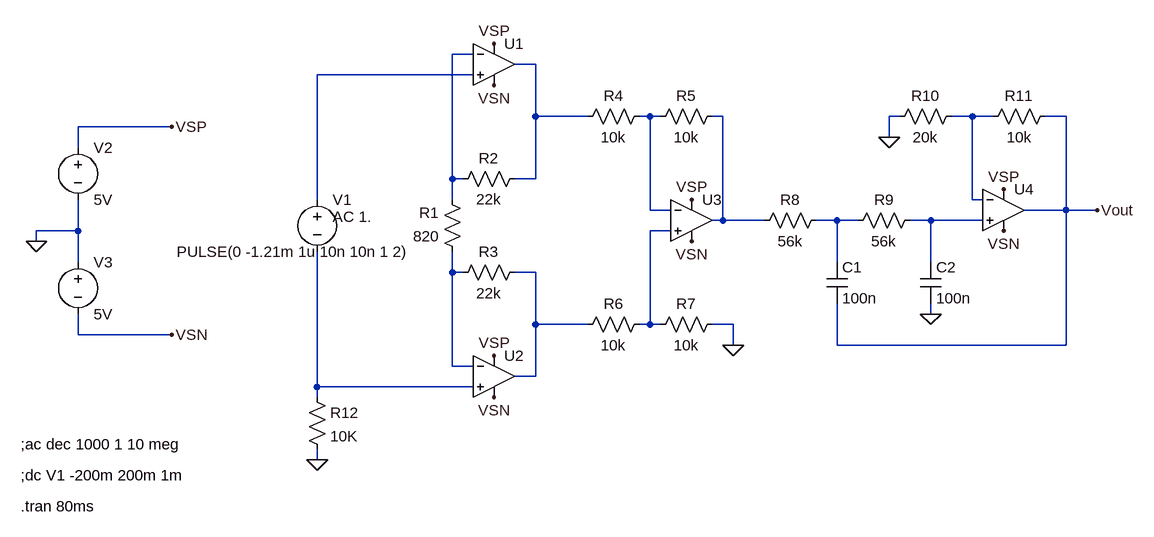
[diagram p0: schematic Schema_proiect.asc]
Schema_proiect.asc, the LTspice schematic file:
Version 4
SHEET 1 1072 680
WIRE 32 -32 0 -32
WIRE 128 -16 96 -16
WIRE 32 0 -208 0
WIRE 128 64 128 -16
WIRE 208 64 128 64
WIRE 304 64 288 64
WIRE 320 64 304 64
WIRE 416 64 400 64
WIRE 688 64 672 64
WIRE 800 64 768 64
WIRE 832 64 800 64
WIRE 944 64 912 64
WIRE -432 80 -576 80
WIRE 672 96 672 64
WIRE -576 112 -576 80
WIRE 0 160 0 -32
WIRE 16 160 0 160
WIRE 128 160 128 64
WIRE 128 160 96 160
WIRE -208 192 -208 0
WIRE 0 192 0 160
WIRE 800 192 800 64
WIRE 816 192 800 192
WIRE 304 208 304 64
WIRE 336 208 304 208
WIRE 944 208 944 64
WIRE 944 208 880 208
WIRE 992 208 944 208
WIRE 416 224 416 64
WIRE 416 224 400 224
WIRE 480 224 416 224
WIRE 592 224 560 224
WIRE 624 224 592 224
WIRE 736 224 704 224
WIRE 816 224 736 224
WIRE -576 240 -576 192
WIRE -576 240 -640 240
WIRE 336 240 304 240
WIRE -640 256 -640 240
WIRE -576 288 -576 240
WIRE 592 288 592 224
WIRE 736 288 736 224
WIRE 0 304 0 272
WIRE 16 304 0 304
WIRE 128 304 96 304
WIRE 736 368 736 352
WIRE 128 384 128 304
WIRE 208 384 128 384
WIRE 304 384 304 240
WIRE 304 384 288 384
WIRE 320 384 304 384
WIRE 432 384 400 384
WIRE -576 400 -576 368
WIRE -432 400 -576 400
WIRE 432 416 432 384
WIRE 592 416 592 352
WIRE 944 416 944 208
WIRE 944 416 592 416
WIRE 0 448 0 304
WIRE 32 448 0 448
WIRE 128 464 128 384
WIRE 128 464 96 464
WIRE -208 480 -208 272
WIRE 32 480 -208 480
WIRE -208 496 -208 480
WIRE -208 592 -208 576
FLAG 736 368 0
FLAG 672 96 0
FLAG 432 416 0
FLAG -208 592 0
FLAG -640 256 0
FLAG -432 80 VSP
FLAG 64 432 VSP
FLAG 64 -48 VSP
FLAG 368 192 VSP
FLAG 848 176 VSP
FLAG -432 400 VSN
FLAG 64 496 VSN
FLAG 368 256 VSN
FLAG 848 240 VSN
FLAG 64 16 VSN
FLAG 992 208 Vout
SYMBOL OpAmps\\UniversalOpamp2 64 -16 R0
SYMATTR InstName U1
SYMBOL OpAmps\\UniversalOpamp2 64 464 R0
SYMATTR InstName U2
SYMBOL OpAmps\\UniversalOpamp2 368 224 R0
SYMATTR InstName U3
SYMBOL OpAmps\\UniversalOpamp2 848 208 R0
SYMATTR InstName U4
SYMBOL res 16 288 R180
WINDOW 0 36 76 Left 2
WINDOW 3 36 40 Left 2
SYMATTR InstName R1
SYMATTR Value 820
SYMBOL res 112 144 R90
WINDOW 0 0 56 VBottom 2
WINDOW 3 32 56 VTop 2
SYMATTR InstName R2
SYMATTR Value 22k
SYMBOL res 112 288 R90
WINDOW 0 0 56 VBottom 2
WINDOW 3 32 56 VTop 2
SYMATTR InstName R3
SYMATTR Value 22k
SYMBOL res 304 48 R90
WINDOW 0 0 56 VBottom 2
WINDOW 3 32 56 VTop 2
SYMATTR InstName R4
SYMATTR Value 10k
SYMBOL res 416 48 R90
WINDOW 0 0 56 VBottom 2
WINDOW 3 32 56 VTop 2
SYMATTR InstName R5
SYMATTR Value 10k
SYMBOL res 304 368 R90
WINDOW 0 0 56 VBottom 2
WINDOW 3 32 56 VTop 2
SYMATTR InstName R6
SYMATTR Value 10k
SYMBOL res 416 368 R90
WINDOW 0 0 56 VBottom 2
WINDOW 3 32 56 VTop 2
SYMATTR InstName R7
SYMATTR Value 10k
SYMBOL res 576 208 R90
WINDOW 0 0 56 VBottom 2
WINDOW 3 32 56 VTop 2
SYMATTR InstName R8
SYMATTR Value 56k
SYMBOL res 720 208 R90
WINDOW 0 0 56 VBottom 2
WINDOW 3 32 56 VTop 2
SYMATTR InstName R9
SYMATTR Value 56k
SYMBOL res 784 48 R90
WINDOW 0 0 56 VBottom 2
WINDOW 3 32 56 VTop 2
SYMATTR InstName R10
SYMATTR Value 20k
SYMBOL res 928 48 R90
WINDOW 0 0 56 VBottom 2
WINDOW 3 32 56 VTop 2
SYMATTR InstName R11
SYMATTR Value 10k
SYMBOL cap 576 288 R0
SYMATTR InstName C1
SYMATTR Value 100n
SYMBOL cap 720 288 R0
SYMATTR InstName C2
SYMATTR Value 100n
SYMBOL res -224 480 R0
SYMATTR InstName R12
SYMATTR Value 10K
SYMBOL voltage -208 176 R0
WINDOW 3 143 96 Right 2
WINDOW 123 54 58 Bottom 2
WINDOW 39 0 0 Left 0
SYMATTR Value PULSE(0 -1.21m 1u 10n 10n 1 2)
SYMATTR Value2 AC 1.
SYMATTR InstName V1
SYMBOL voltage -576 96 R0
WINDOW 123 0 0 Left 0
WINDOW 39 0 0 Left 0
SYMATTR InstName V2
SYMATTR Value 5V
SYMBOL voltage -576 272 R0
WINDOW 123 0 0 Left 0
WINDOW 39 0 0 Left 0
SYMATTR InstName V3
SYMATTR Value 5V
TEXT -664 616 Left 2 !;dc V1 -200m 200m 1m
TEXT -664 568 Left 2 !;ac dec 1000 1 10 meg
TEXT -664 664 Left 2 !.tran 80ms

The netlist it stands for:
* Schema_proiect.asc
XU1 N003 N001 VSP VSN N002 level.2 Avol=1Meg GBW=10Meg Slew=10Meg ilimit=25m rail=0 Vos=0 phimargin=45 en=0 enk=0 in=0 ink=0 Rin=500Meg  ; pins IN+ IN- V+ V- OUT
XU2 N012 N010 VSP VSN N011 level.2 Avol=1Meg GBW=10Meg Slew=10Meg ilimit=25m rail=0 Vos=0 phimargin=45 en=0 enk=0 in=0 ink=0 Rin=500Meg  ; pins IN+ IN- V+ V- OUT
XU3 N009 N004 VSP VSN N005 level.2 Avol=1Meg GBW=10Meg Slew=10Meg ilimit=25m rail=0 Vos=0 phimargin=45 en=0 enk=0 in=0 ink=0 Rin=500Meg  ; pins IN+ IN- V+ V- OUT
XU4 N008 N006 VSP VSN Vout level.2 Avol=1Meg GBW=10Meg Slew=10Meg ilimit=25m rail=0 Vos=0 phimargin=45 en=0 enk=0 in=0 ink=0 Rin=500Meg  ; pins IN+ IN- V+ V- OUT
R1 N010 N001 820
R2 N002 N001 22k
R3 N011 N010 22k
R4 N004 N002 10k
R5 N005 N004 10k
R6 N009 N011 10k
R7 0 N009 10k
R8 N007 N005 56k
R9 N008 N007 56k
R10 N006 0 20k
R11 Vout N006 10k
C1 N007 Vout 100n
C2 N008 0 100n
R12 N012 0 10K
V1 N003 N012 PULSE(0 -1.21m 1u 10n 10n 1 2) AC 1.
V2 VSP 0 5V
V3 0 VSN 5V
;dc V1 -200m 200m 1m
;ac dec 1000 1 10 meg
.tran 80ms
.lib UniversalOpamps2.sub
.backanno
.end